# Altium project Drone_v1.0.PrjPCB
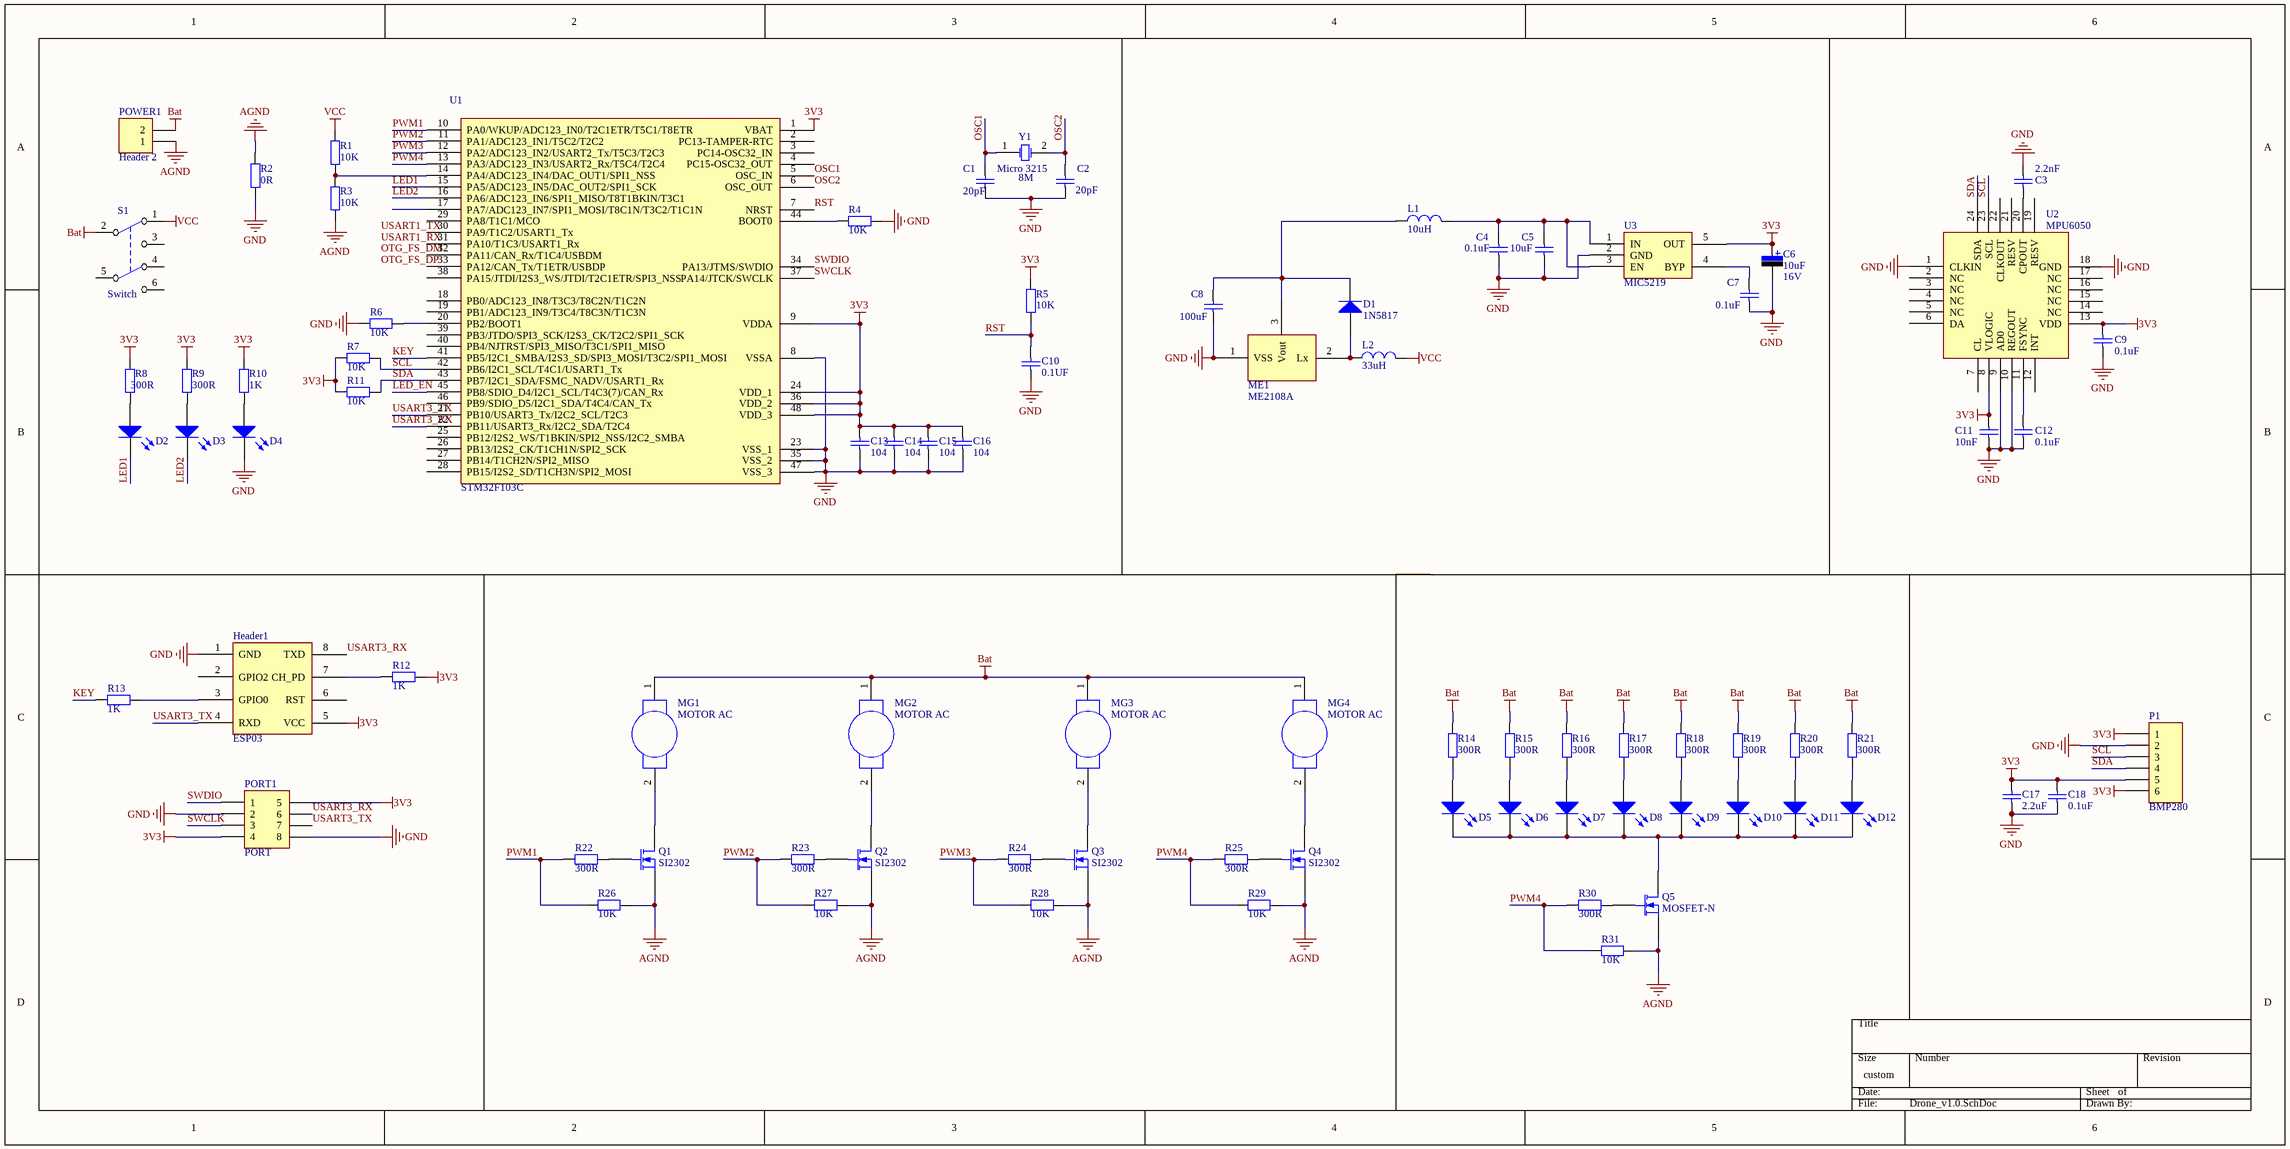
[diagram p0: Drone_v1.0.SchDoc]
1 sheet, 82 parts. Net scope: global (net labels, ports and power ports of the same name join across sheets).
Board file: Drone_v1.0.PcbDoc

## Sheet Drone_v1.0.SchDoc
size 508 x 254 mm

### Parts
C1  value 20pF  [0805-2]  (hidden comment: 0402 12pF)
C2  value 20pF  [0805-2]  (hidden comment: 0402 12pF)
C3  50V: 2.2nF  [0805-2]  (hidden comment: 0402 12pF)
C4  value 0.1uF  [0805-2]  (hidden comment: 0402 12pF)
C5  value 10uF  [0805-2]  (hidden comment: 0402 12pF)
C6  value 10uF  Vol: 16V  [1206]  (hidden comment: Cap Pol)
C7  50V: 0.1uF  [0805-2]  (hidden comment: 0402 12pF)
C8  value 100uF  [0805-2]  (hidden comment: 0402 12pF)
C9  50V: 0.1uF  [0805-2]  (hidden comment: 0402 12pF)
C10  value 0.1UF  [0805-2]  (hidden comment: Cap)
C11  50V: 10nF  [0805-2]  (hidden comment: 0402 12pF)
C12  50V: 0.1uF  [0805-2]  (hidden comment: 0402 12pF)
C13  value 104  [0805-2]  (hidden comment: Cap)
C14  value 104  [0805-2]  (hidden comment: Cap)
C15  value 104  [0805-2]  (hidden comment: Cap)
C16  value 104  [0805-2]  (hidden comment: Cap)
C17  50V: 2.2uF  [0805-2]  (hidden comment: 0402 12pF)
C18  50V: 0.1uF  [0805-2]  (hidden comment: 0402 12pF)
D1  Type: 1N5817  [DIODE-1206]  (hidden comment: Diode)
D2  LED0  [LED_0805]  (value not drawn)
D3  LED0  [LED_0805]  (value not drawn)
D4  LED0  [LED_0805]  (value not drawn)
D5  LED0  [LED_0805]  (value not drawn)
D6  LED0  [LED_0805]  (value not drawn)
D7  LED0  [LED_0805]  (value not drawn)
D8  LED0  [LED_0805]  (value not drawn)
D9  LED0  [LED_0805]  (value not drawn)
D10  LED0  [LED_0805]  (value not drawn)
D11  LED0  [LED_0805]  (value not drawn)
D12  LED0  [LED_0805]  (value not drawn)
Header1  ESP03  [PCBComponent_1]
L1  value 10uH  [0805-1]  (hidden comment: Inductor)
L2  value 33uH  [0805-1]  (hidden comment: Inductor)
ME1  ME2108A  [SOT-89]
MG1  MOTOR AC  [Motor]
MG2  MOTOR AC  [Motor]
MG3  MOTOR AC  [Motor]
MG4  MOTOR AC  [Motor]
P1  BMP280  [HDR1X6]
PORT1  PORT  [HDR2X4_CEN]
POWER1  Header 2  [HDR1X2]
Q1  SI2302  [SOT-23]
Q2  SI2302  [SOT-23]
Q3  SI2302  [SOT-23]
Q4  SI2302  [SOT-23]
Q5  MOSFET-N  [SOT-23]
R1  value 10K  [0805-2]  (hidden comment: Res1)
R2  value 0R  [0805-2]  (hidden comment: Res1)
R3  value 10K  [0805-2]  (hidden comment: Res1)
R4  value 10K  [0805-2]  (hidden comment: Res1)
R5  value 10K  [0805-2]  (hidden comment: Res1)
R6  value 10K  [0805-2]  (hidden comment: Res1)
R7  value 10K  [0805-2]  (hidden comment: Res1)
R8  value 300R  [0805-2]  (hidden comment: Res1)
R9  value 300R  [0805-2]  (hidden comment: Res1)
R10  value 1K  [0805-2]  (hidden comment: Res1)
R11  value 10K  [0805-2]  (hidden comment: Res1)
R12  value 1K  [0805-2]  (hidden comment: Res1)
R13  value 1K  [0805-2]  (hidden comment: Res1)
R14  value 300R  [0805-2]  (hidden comment: Res1)
R15  value 300R  [0805-2]  (hidden comment: Res1)
R16  value 300R  [0805-2]  (hidden comment: Res1)
R17  value 300R  [0805-2]  (hidden comment: Res1)
R18  value 300R  [0805-2]  (hidden comment: Res1)
R19  value 300R  [0805-2]  (hidden comment: Res1)
R20  value 300R  [0805-2]  (hidden comment: Res1)
R21  value 300R  [0805-2]  (hidden comment: Res1)
R22  value 300R  [0805-2]  (hidden comment: Res1)
R23  value 300R  [0805-2]  (hidden comment: Res1)
R24  value 300R  [0805-2]  (hidden comment: Res1)
R25  value 300R  [0805-2]  (hidden comment: Res1)
R26  value 10K  [0805-2]  (hidden comment: Res1)
R27  value 10K  [0805-2]  (hidden comment: Res1)
R28  value 10K  [0805-2]  (hidden comment: Res1)
R29  value 10K  [0805-2]  (hidden comment: Res1)
R30  value 300R  [0805-2]  (hidden comment: Res1)
R31  value 10K  [0805-2]  (hidden comment: Res1)
S1  Switch  [开关]
U1  STM32F103C  [LQFP-48_M]
U2  MPU6050  [QFN50P400X400X90-24N]
U3  MIC5219  [SOT25-5]
Y1  Micro 3215  value 8M  [XTAL5]

### Nets
3V3: C6.1 C9.1 C11.1 C13.2 C14.2 C15.2 C16.2 C17.1 C18.1 Header1.5(VCC) P1.1 P1.5 P1.6 PORT1.4 PORT1.5 R5.2 R7.1 R8.2 R9.2 R10.2 R11.1 R12.2 U1.1(VBAT) U1.9(VDDA) U1.24(VDD_1) U1.36(VDD_2) U1.48(VDD_3) U2.8(VLOGIC) U2.13(VDD) U3.5(OUT)
AGND: POWER1.1 Q1.3(S) Q2.3(S) Q3.3(S) Q4.3(S) Q5.3(S) R2.2 R3.2 R26.1 R27.1 R28.1 R29.1 R31.1
Bat: MG1.1 MG2.1 MG3.1 MG4.1 POWER1.2 R14.1 R15.1 R16.1 R17.1 R18.1 R19.1 R20.1 R21.1 S1.2(COMMON1)
GND: C1.2 C2.1 C3.1 C4.2 C5.2 C6.2 C7.2 C8.2 C9.2 C10.2 C11.2 C12.2 C13.1 C14.1 C15.1 C16.1 C17.2 C18.2 D4.2(K) Header1.1(GND) ME1.1(VSS) P1.2 PORT1.2 PORT1.8 R2.1 R4.1 R6.1 U1.8(VSSA) U1.23(VSS_1) U1.35(VSS_2) U1.47(VSS_3) U2.1(CLKIN) U2.9(AD0) U2.10(REGOUT) U2.18(GND) U3.2(GND)
VCC: L2.2 R1.2 S1.1(NC1)
KEY: R13.1 U1.41(PB5/I2C1_SMBA/I2S3_SD/SPI3_MOSI/T3C2/SPI1_MOSI)
LED1: D2.2(K) U1.15(PA5/ADC123_IN5/DAC_OUT2/SPI1_SCK)
LED2: D3.2(K) U1.16(PA6/ADC123_IN6/SPI1_MISO/T8T1BKIN/T3C1)
LED_EN: U1.45(PB8/SDIO_D4/I2C1_SCL/T4C3(7)/CAN_Rx)
OSC1: C1.1 U1.5(OSC_IN) Y1.1(OSC1)
OSC2: C2.2 U1.6(OSC_OUT) Y1.2(OSC2)
PWM1: R22.2 R26.2 U1.10(PA0/WKUP/ADC123_IN0/T2C1ETR/T5C1/T8ETR)
PWM2: R23.2 R27.2 U1.11(PA1/ADC123_IN1/T5C2/T2C2)
PWM3: R24.2 R28.2 U1.12(PA2/ADC123_IN2/USART2_Tx/T5C3/T2C3)
PWM4: R25.2 R29.2 R30.2 R31.2 U1.13(PA3/ADC123_IN3/USART2_Rx/T5C4/T2C4)
RST: C10.1 R5.1 U1.7(NRST)
SCL: P1.3 R7.2 U1.42(PB6/I2C1_SCL/T4C1/USART1_Tx) U2.23(SCL)
SDA: P1.4 R11.2 U1.43(PB7/I2C1_SDA/FSMC_NADV/USART1_Rx) U2.24(SDA)
SWCLK: PORT1.3 U1.37(PA14/JTCK/SWCLK)
SWDIO: PORT1.1 U1.34(PA13/JTMS/SWDIO)
USART3_RX: Header1.8(TXD) PORT1.6 U1.22(PB11/USART3_Rx/I2C2_SDA/T2C4)
USART3_TX: Header1.4(RXD) PORT1.7 U1.21(PB10/USART3_Tx/I2C2_SCL/T2C3)
NetC3_2: C3.2 U2.20(CPOUT)
NetC4_1: C4.1 C5.1 L1.2 U3.1(IN) U3.3(EN)
NetC7_1: C7.1 U3.4(BYP)
NetC8_1: C8.1 D1.2(K) L1.1 ME1.3(Vout)
NetC12_1: C12.1 U2.11(FSYNC)
NetD1_1: D1.1(A) L2.1 ME1.2(Lx)
NetD2_1: D2.1(A) R8.1
NetD3_1: D3.1(A) R9.1
NetD4_1: D4.1(A) R10.1
NetD5_1: D5.1(A) R14.2
NetD5_2: D5.2(K) D6.2(K) D7.2(K) D8.2(K) D9.2(K) D10.2(K) D11.2(K) D12.2(K) Q5.1(D)
NetD6_1: D6.1(A) R15.2
NetD7_1: D7.1(A) R16.2
NetD8_1: D8.1(A) R17.2
NetD9_1: D9.1(A) R18.2
NetD10_1: D10.1(A) R19.2
NetD11_1: D11.1(A) R20.2
NetD12_1: D12.1(A) R21.2
NetHeader1_3: Header1.3(GPIO0) R13.2
NetHeader1_7: Header1.7(CH_PD) R12.1
NetMG1_2: MG1.2 Q1.1(D)
NetMG2_2: MG2.2 Q2.1(D)
NetMG3_2: MG3.2 Q3.1(D)
NetMG4_2: MG4.2 Q4.1(D)
NetQ1_2: Q1.2(G) R22.1
NetQ2_2: Q2.2(G) R23.1
NetQ3_2: Q3.2(G) R24.1
NetQ4_2: Q4.2(G) R25.1
NetQ5_2: Q5.2(G) R30.1
NetR1_1: R1.1 R3.1 U1.14(PA4/ADC123_IN4/DAC_OUT1/SPI1_NSS)
NetR4_2: R4.2 U1.44(BOOT0)
NetR6_2: R6.2 U1.20(PB2/BOOT1)

Not connected (* = marked no-connect by the designer): Header1 2(GPIO2) 6(RST); S1 3(NO1) 4(NC2) 5(COMMON2) 6(NO2); U1 2(PC13-TAMPER-RTC) 3(PC14-OSC32_IN) 4(PC15-OSC32_OUT) 17(PA7/ADC123_IN7/SPI1_MOSI/T8C1N/T3C2/T1C1N) 18(PB0/ADC123_IN8/T3C3/T8C2N/T1C2N) 19(PB1/ADC123_IN9/T3C4/T8C3N/T1C3N) 25(PB12/I2S2_WS/T1BKIN/SPI2_NSS/I2C2_SMBA) 26(PB13/I2S2_CK/T1CH1N/SPI2_SCK) 27(PB14/T1CH2N/SPI2_MISO) 28(PB15/I2S2_SD/T1CH3N/SPI2_MOSI) 29(PA8/T1C1/MCO) 30(PA9/T1C2/USART1_Tx) 31(PA10/T1C3/USART1_Rx) 32(PA11/CAN_Rx/T1C4/USBDM) 33(PA12/CAN_Tx/T1ETR/USBDP) 38(PA15/JTDI/I2S3_WS/JTDI/T2C1ETR/SPI3_NSS) 39(PB3/JTDO/SPI3_SCK/I2S3_CK/T2C2/SPI1_SCK) 40(PB4/NJTRST/SPI3_MISO/T3C1/SPI1_MISO) 46(PB9/SDIO_D5/I2C1_SDA/T4C4/CAN_Tx); U2 2(NC) 3(NC) 4(NC) 5(NC) 6(DA) 7(CL) 12(INT) 14(NC) 15(NC) 16(NC) 17(NC) 19(RESV) 21(RESV) 22(CLKOUT)

### Notes on the sheet
- Labels drawn without touching a wire or pin: OTG_FS_DM, OTG_FS_DP, USART1_RX, USART1_TX

### Library data of the parts
C1-C5 C7-C9 C11 C12 C17 C18 = Cap: Capacitor; Published: 8-Jun-2000; LatestRevisionDate: 17-Jul-2002; LatestRevisionNote: Re-released for DXP Platform.; PackageReference: RAD-0.3; Publisher: Altium Limited; PackageDescription: Radial Cap, Thru-Hole; 2 Leads; 0.3 in Pin Spacing
C6 = Cap Pol: 极性电解电容; Published: 8-Jun-2000; LatestRevisionDate: 17-Jul-2002; LatestRevisionNote: Re-released for DXP Platform.; PackageReference: RB7.6-15; Publisher: Altium Limited
C10 C13-C16 = Cap: 无极性电容; Published: 8-Jun-2000; LatestRevisionDate: 17-Jul-2002; LatestRevisionNote: Re-released for DXP Platform.; PackageReference: RAD-0.3; Publisher: Altium Limited
D1 = Diode: 二极管; Published: 8-Jun-2000; LatestRevisionDate: 17-Jul-2002; LatestRevisionNote: Re-released for DXP Platform.; PackageDocument: Sep-1996; PackageReference: SMC; Publisher: Altium Limited; Code_JEDEC: DO-214-AB
D2-D12 = LED0: 发光二极管; Published: 8-Jun-2000; LatestRevisionDate: 08-Jul-2005; LatestRevisionNote: Mech Layer 1 removed.; PackageReference: LED-0; Publisher: Altium Limited
Header1 = Hearder
L1 L2 = Inductor: 电感; Code_IEC: 1005; Published: 8-Jun-2000; LatestRevisionDate: 17-Jul-2002; LatestRevisionNote: Re-released for DXP Platform.; PackageReference: 0402-A; Publisher: Altium Limited; Code_JEITA: 0402
P1 = Header 6: Header, 6-Pin; LatestRevisionDate: 17-Jul-2002; LatestRevisionNote: Re-released for DXP Platform.; Publisher: Altium Limited
PORT1 = Header 4X2A: Header, 4-Pin, Dual row; LatestRevisionDate: 17-Jul-2002; LatestRevisionNote: Re-released for DXP Platform.; Publisher: Altium Limited
POWER1 = Header 2: Header, 2-Pin; LatestRevisionDate: 17-Jul-2002; LatestRevisionNote: Re-released for DXP Platform.; Publisher: Altium Limited
Q1-Q5 = MOSFET-N: N-Channel MOSFET; Published: 8-Jun-2000; LatestRevisionDate: 17-Jul-2002; LatestRevisionNote: Re-released for DXP Platform.; PackageVersion: 1995/1996; PackageReference: E3; Publisher: Altium Limited; PackageDescription: TO, Flat Index; 3 In-Line, Axial Leads; Body Dia. 4.6mm; Lead Dia. 0.5 mm (max)
R1-R31 = Res1: 贴片电阻; Published: 8-Jun-2000; LatestRevisionDate: 17-Jul-2002; LatestRevisionNote: Re-released for DXP Platform.; PackageReference: AXIAL-0.4; Publisher: Altium Limited
S1 = 双刀双柄开关
U1 = STM32F103C: STM32单片机48引脚
Y1 = XTAL: Crystal Oscillator